# Altium project PCB_PROJECT1.PRJPCB
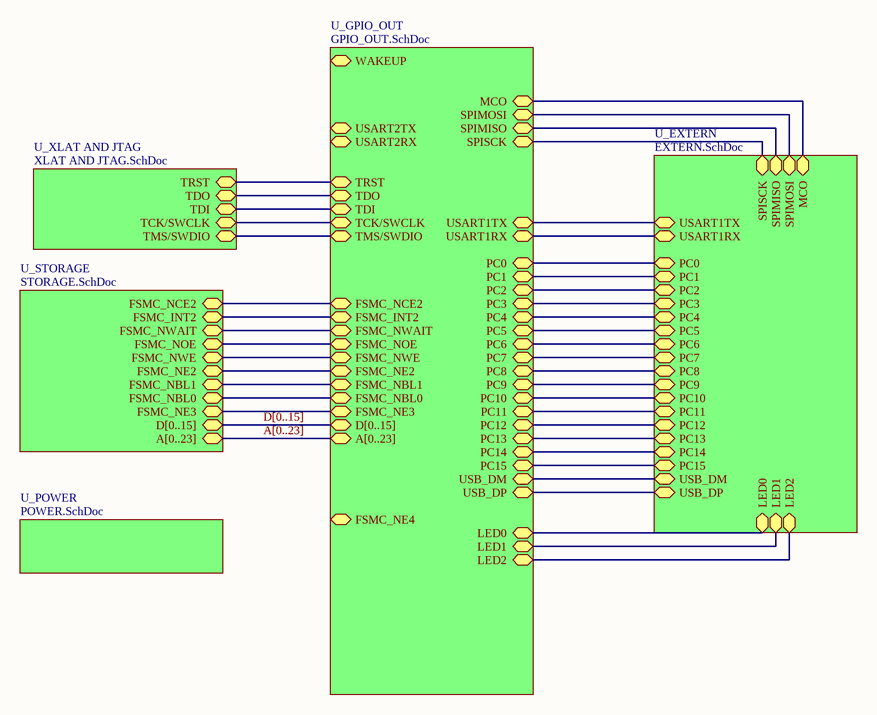
[diagram p0: main.SchDoc]
5 sheets, 53 parts. Net scope: global (net labels, ports and power ports of the same name join across sheets).
Board files: PCB3.PcbDoc, trd5.PcbDoc, PCB2CPY.PcbDoc, PCB2.PcbDoc
Sheets:
  main.SchDoc
    U_GPIO_OUT = GPIO_OUT.SchDoc
    U_XLAT AND JTAG = XLAT AND JTAG.SchDoc
    U_EXTERN = EXTERN.SchDoc
    U_POWER = POWER.SchDoc

## Sheet main.SchDoc
size A4; PageSetup: Record=PageOptions|CenterHorizontal=True|CenterVertical=True|PrintScale=1.00|XCorrection=1.00|YCorrection=1.00|PrintKind=2|BorderSize=5000000|LeftOffset=0|BottomOffset=0|Orientation=2|PaperLength=1000|PaperWidth=1000|Scale=100|PaperSource=7|PrintQuality=-4|MediaType=1|DitherType=10|PaperKind=A4|PrintScaleMode=1

### Sub-sheets
U_EXTERN = EXTERN.SchDoc: USB_DM (bidir), USB_DP (bidir), LED0 (bidir), LED1 (bidir), LED2 (bidir), USART1TX (bidir), USART1RX (bidir), PC0 (bidir), PC1 (bidir), PC2 (bidir), PC3 (bidir), PC4 (bidir), PC5 (bidir), PC6 (bidir), PC7 (bidir), PC8 (bidir), PC9 (bidir), PC10 (bidir), PC11 (bidir), PC12 (bidir), PC13 (bidir), PC14 (bidir), PC15 (bidir), SPISCK (bidir), SPIMISO (bidir), SPIMOSI (bidir), MCO (bidir)
U_GPIO_OUT = GPIO_OUT.SchDoc: WAKEUP (bidir), USART2TX (bidir), USART2RX (bidir), SPISCK (bidir), SPIMISO (bidir), SPIMOSI (bidir), MCO (bidir), USART1TX (bidir), USART1RX (bidir), TMS/SWDIO (bidir), TCK/SWCLK (bidir), TDI (bidir), TDO (bidir), TRST (bidir), A[0..23] (bidir), D[0..15] (bidir), USB_DM (bidir), USB_DP (bidir), FSMC_NE4 (bidir), FSMC_NE3 (bidir), FSMC_NE2 (bidir), FSMC_INT2 (bidir), FSMC_NBL1 (bidir), FSMC_NBL0 (bidir), FSMC_NCE2 (bidir), FSMC_NWAIT (bidir), FSMC_NWE (bidir), FSMC_NOE (bidir), LED0 (bidir), LED1 (bidir), LED2 (bidir), PC0 (bidir), PC1 (bidir), PC2 (bidir), PC3 (bidir), PC4 (bidir), PC5 (bidir), PC6 (bidir), PC7 (bidir), PC8 (bidir), PC9 (bidir), PC10 (bidir), PC11 (bidir), PC12 (bidir), PC13 (bidir), PC14 (bidir), PC15 (bidir)
U_POWER = POWER.SchDoc: no entries
U_STORAGE = STORAGE.SchDoc (file not in this document): A[0..23] (bidir), D[0..15] (bidir), FSMC_NE3 (bidir), FSMC_NBL0 (bidir), FSMC_NBL1 (bidir), FSMC_NE2 (bidir), FSMC_NWE (bidir), FSMC_NOE (bidir), FSMC_NWAIT (bidir), FSMC_INT2 (bidir), FSMC_NCE2 (bidir)
U_XLAT AND JTAG = XLAT AND JTAG.SchDoc: TMS/SWDIO (bidir), TCK/SWCLK (bidir), TDI (bidir), TDO (bidir), TRST (bidir)

### Nets
(unnamed): sheet U_GPIO_OUT/SPISCK, sheet U_EXTERN/SPISCK
(unnamed): sheet U_GPIO_OUT/SPIMISO, sheet U_EXTERN/SPIMISO
(unnamed): sheet U_GPIO_OUT/SPIMOSI, sheet U_EXTERN/SPIMOSI
(unnamed): sheet U_GPIO_OUT/MCO, sheet U_EXTERN/MCO
(unnamed): sheet U_GPIO_OUT/USART1TX, sheet U_EXTERN/USART1TX
(unnamed): sheet U_GPIO_OUT/USART1RX, sheet U_EXTERN/USART1RX
(unnamed): sheet U_GPIO_OUT/TMS/SWDIO, sheet U_XLAT AND JTAG/TMS/SWDIO
(unnamed): sheet U_GPIO_OUT/TCK/SWCLK, sheet U_XLAT AND JTAG/TCK/SWCLK
(unnamed): sheet U_GPIO_OUT/TDI, sheet U_XLAT AND JTAG/TDI
(unnamed): sheet U_GPIO_OUT/TDO, sheet U_XLAT AND JTAG/TDO
(unnamed): sheet U_GPIO_OUT/TRST, sheet U_XLAT AND JTAG/TRST
(unnamed): sheet U_GPIO_OUT/USB_DM, sheet U_EXTERN/USB_DM
(unnamed): sheet U_GPIO_OUT/USB_DP, sheet U_EXTERN/USB_DP
(unnamed): sheet U_GPIO_OUT/FSMC_NE3, sheet U_STORAGE/FSMC_NE3
(unnamed): sheet U_GPIO_OUT/FSMC_NE2, sheet U_STORAGE/FSMC_NE2
(unnamed): sheet U_GPIO_OUT/FSMC_INT2, sheet U_STORAGE/FSMC_INT2
(unnamed): sheet U_GPIO_OUT/FSMC_NBL1, sheet U_STORAGE/FSMC_NBL1
(unnamed): sheet U_GPIO_OUT/FSMC_NBL0, sheet U_STORAGE/FSMC_NBL0
(unnamed): sheet U_GPIO_OUT/FSMC_NCE2, sheet U_STORAGE/FSMC_NCE2
(unnamed): sheet U_GPIO_OUT/FSMC_NWAIT, sheet U_STORAGE/FSMC_NWAIT
(unnamed): sheet U_GPIO_OUT/FSMC_NWE, sheet U_STORAGE/FSMC_NWE
(unnamed): sheet U_GPIO_OUT/FSMC_NOE, sheet U_STORAGE/FSMC_NOE
(unnamed): sheet U_GPIO_OUT/LED0, sheet U_EXTERN/LED0
(unnamed): sheet U_GPIO_OUT/LED1, sheet U_EXTERN/LED1
(unnamed): sheet U_GPIO_OUT/LED2, sheet U_EXTERN/LED2
(unnamed): sheet U_GPIO_OUT/PC0, sheet U_EXTERN/PC0
(unnamed): sheet U_GPIO_OUT/PC1, sheet U_EXTERN/PC1
(unnamed): sheet U_GPIO_OUT/PC2, sheet U_EXTERN/PC2
(unnamed): sheet U_GPIO_OUT/PC3, sheet U_EXTERN/PC3
(unnamed): sheet U_GPIO_OUT/PC4, sheet U_EXTERN/PC4
(unnamed): sheet U_GPIO_OUT/PC5, sheet U_EXTERN/PC5
(unnamed): sheet U_GPIO_OUT/PC6, sheet U_EXTERN/PC6
(unnamed): sheet U_GPIO_OUT/PC7, sheet U_EXTERN/PC7
(unnamed): sheet U_GPIO_OUT/PC8, sheet U_EXTERN/PC8
(unnamed): sheet U_GPIO_OUT/PC9, sheet U_EXTERN/PC9
(unnamed): sheet U_GPIO_OUT/PC10, sheet U_EXTERN/PC10
(unnamed): sheet U_GPIO_OUT/PC11, sheet U_EXTERN/PC11
(unnamed): sheet U_GPIO_OUT/PC12, sheet U_EXTERN/PC12
(unnamed): sheet U_GPIO_OUT/PC13, sheet U_EXTERN/PC13
(unnamed): sheet U_GPIO_OUT/PC14, sheet U_EXTERN/PC14
(unnamed): sheet U_GPIO_OUT/PC15, sheet U_EXTERN/PC15

### Buses and harness runs
bus A[0..23] = sheet U_GPIO_OUT/A[0..23] = sheet U_STORAGE/A[0..23]
bus D[0..15] = sheet U_GPIO_OUT/D[0..15] = sheet U_STORAGE/D[0..15]

## Sheet GPIO_OUT.SchDoc
size B
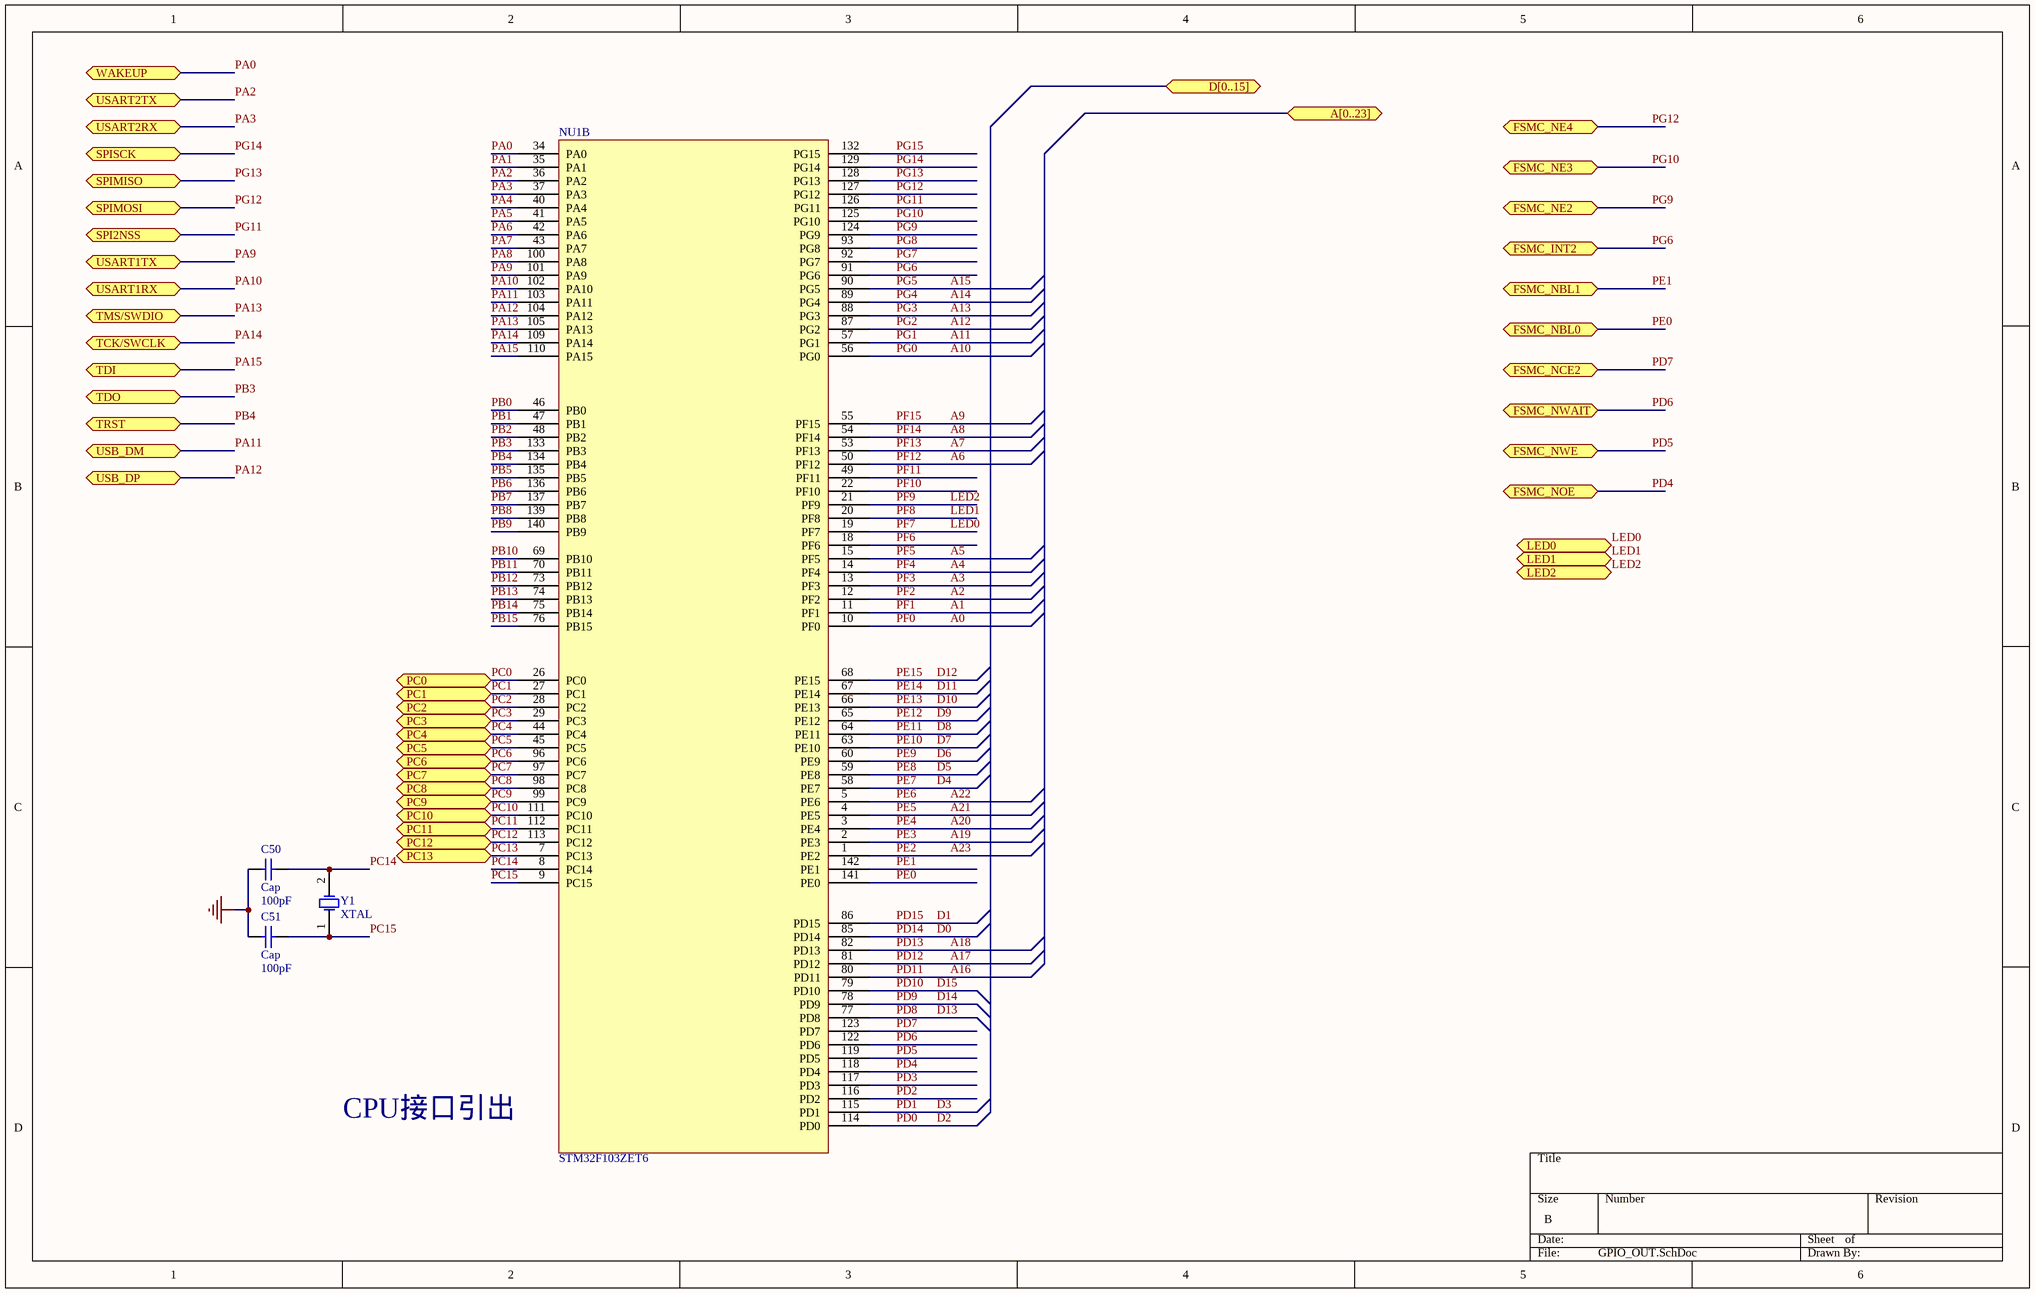
[diagram p1: GPIO_OUT.SchDoc]

### Parts
C50  Cap  value 100pF  [0805]
C51  Cap  value 100pF  [0805]
NU1  STM32F103ZET6  (part B of 3)
Y1  XTAL  [XTAL-1]

### Ports
A[0..23] (bidir), D[0..15] (bidir), FSMC_INT2 (bidir), FSMC_NBL0 (bidir), FSMC_NBL1 (bidir), FSMC_NCE2 (bidir), FSMC_NE2 (bidir), FSMC_NE3 (bidir), FSMC_NE4 (bidir), FSMC_NOE (bidir), FSMC_NWAIT (bidir), FSMC_NWE (bidir), LED0 (bidir), LED1 (bidir), LED2 (bidir), PC0 (bidir), PC1 (bidir), PC2 (bidir), PC3 (bidir), PC4 (bidir), PC5 (bidir), PC6 (bidir), PC7 (bidir), PC8 (bidir), PC9 (bidir), PC10 (bidir), PC11 (bidir), PC12 (bidir), PC13 (bidir), SPI2NSS (bidir), SPIMISO (bidir), SPIMOSI (bidir), SPISCK (bidir), TCK/SWCLK (bidir), TDI (bidir), TDO (bidir), TMS/SWDIO (bidir), TRST (bidir), USART1RX (bidir), USART1TX (bidir), USART2RX (bidir), USART2TX (bidir), USB_DM (bidir), USB_DP (bidir), WAKEUP (bidir)

### Nets
GND: C50.1 C51.1
A0: NU1.10(PF0)  [also labelled PF0]
A1: NU1.11(PF1)  [also labelled PF1]
A2: NU1.12(PF2)  [also labelled PF2]
A3: NU1.13(PF3)  [also labelled PF3]
A4: NU1.14(PF4)  [also labelled PF4]
A5: NU1.15(PF5)  [also labelled PF5]
A6: NU1.50(PF12)  [also labelled PF12]
A7: NU1.53(PF13)  [also labelled PF13]
A8: NU1.54(PF14)  [also labelled PF14]
A9: NU1.55(PF15)  [also labelled PF15]
A10: NU1.56(PG0)  [also labelled PG0]
A11: NU1.57(PG1)  [also labelled PG1]
A12: NU1.87(PG2)  [also labelled PG2]
A13: NU1.88(PG3)  [also labelled PG3]
A14: NU1.89(PG4)  [also labelled PG4]
A15: NU1.90(PG5)  [also labelled PG5]
A16: NU1.80(PD11)  [also labelled PD11]
A17: NU1.81(PD12)  [also labelled PD12]
A18: NU1.82(PD13)  [also labelled PD13]
A19: NU1.2(PE3)  [also labelled PE3]
A20: NU1.3(PE4)  [also labelled PE4]
A21: NU1.4(PE5)  [also labelled PE5]
A22: NU1.5(PE6)  [also labelled PE6]
A23: NU1.1(PE2)  [also labelled PE2]
D0: NU1.85(PD14)  [also labelled PD14]
D1: NU1.86(PD15)  [also labelled PD15]
D2: NU1.114(PD0)  [also labelled PD0]
D3: NU1.115(PD1)  [also labelled PD1]
D4: NU1.58(PE7)  [also labelled PE7]
D5: NU1.59(PE8)  [also labelled PE8]
D6: NU1.60(PE9)  [also labelled PE9]
D7: NU1.63(PE10)  [also labelled PE10]
D8: NU1.64(PE11)  [also labelled PE11]
D9: NU1.65(PE12)  [also labelled PE12]
D10: NU1.66(PE13)  [also labelled PE13]
D11: NU1.67(PE14)  [also labelled PE14]
D12: NU1.68(PE15)  [also labelled PE15]
D13: NU1.77(PD8)  [also labelled PD8]
D14: NU1.78(PD9)  [also labelled PD9]
D15: NU1.79(PD10)  [also labelled PD10]
LED0: NU1.19(PF7) ; port LED0  [also labelled PF7]
LED1: NU1.20(PF8) ; port LED1  [also labelled PF8]
LED2: NU1.21(PF9) ; port LED2  [also labelled PF9]
PA0: NU1.34(PA0) ; port WAKEUP
PA1: NU1.35(PA1)
PA2: NU1.36(PA2) ; port USART2TX
PA3: NU1.37(PA3) ; port USART2RX
PA4: NU1.40(PA4)
PA5: NU1.41(PA5)
PA6: NU1.42(PA6)
PA7: NU1.43(PA7)
PA8: NU1.100(PA8)
PA9: NU1.101(PA9) ; port USART1TX
PA10: NU1.102(PA10) ; port USART1RX
PA11: NU1.103(PA11) ; port USB_DM
PA12: NU1.104(PA12) ; port USB_DP
PA13: NU1.105(PA13) ; port TMS/SWDIO
PA14: NU1.109(PA14) ; port TCK/SWCLK
PA15: NU1.110(PA15) ; port TDI
PB0: NU1.46(PB0)
PB1: NU1.47(PB1)
PB2: NU1.48(PB2)
PB3: NU1.133(PB3) ; port TDO
PB4: NU1.134(PB4) ; port TRST
PB5: NU1.135(PB5)
PB6: NU1.136(PB6)
PB7: NU1.137(PB7)
PB8: NU1.139(PB8)
PB9: NU1.140(PB9)
PB10: NU1.69(PB10)
PB11: NU1.70(PB11)
PB12: NU1.73(PB12)
PB13: NU1.74(PB13)
PB14: NU1.75(PB14)
PB15: NU1.76(PB15)
PC0: NU1.26(PC0) ; port PC0
PC1: NU1.27(PC1) ; port PC1
PC2: NU1.28(PC2) ; port PC2
PC3: NU1.29(PC3) ; port PC3
PC4: NU1.44(PC4) ; port PC4
PC5: NU1.45(PC5) ; port PC5
PC6: NU1.96(PC6) ; port PC6
PC7: NU1.97(PC7) ; port PC7
PC8: NU1.98(PC8) ; port PC8
PC9: NU1.99(PC9) ; port PC9
PC10: NU1.111(PC10) ; port PC10
PC11: NU1.112(PC11) ; port PC11
PC12: NU1.113(PC12) ; port PC12
PC13: NU1.7(PC13) ; port PC13
PC14: C50.2 NU1.8(PC14) Y1.2(OSC2)
PC15: C51.2 NU1.9(PC15) Y1.1(OSC1)
PD2: NU1.116(PD2)
PD3: NU1.117(PD3)
PD4: NU1.118(PD4) ; port FSMC_NOE
PD5: NU1.119(PD5) ; port FSMC_NWE
PD6: NU1.122(PD6) ; port FSMC_NWAIT
PD7: NU1.123(PD7) ; port FSMC_NCE2
PE0: NU1.141(PE0) ; port FSMC_NBL0
PE1: NU1.142(PE1) ; port FSMC_NBL1
PF6: NU1.18(PF6)
PF10: NU1.22(PF10)
PF11: NU1.49(PF11)
PG6: NU1.91(PG6) ; port FSMC_INT2
PG7: NU1.92(PG7)
PG8: NU1.93(PG8)
PG9: NU1.124(PG9) ; port FSMC_NE2
PG10: NU1.125(PG10) ; port FSMC_NE3
PG11: NU1.126(PG11) ; port SPI2NSS
PG12: NU1.127(PG12) ; port SPIMOSI, port FSMC_NE4
PG13: NU1.128(PG13) ; port SPIMISO
PG14: NU1.129(PG14) ; port SPISCK
PG15: NU1.132(PG15)

### Notes on the sheet
- CPU接口引出

### Library data of the parts
C50 C51 = Cap: Capacitor; Published: 8-Jun-2000; LatestRevisionDate: 17-Jul-2002; LatestRevisionNote: Re-released for DXP Platform.; PackageReference: RAD-0.3; Publisher: Altium Limited
Y1 = XTAL: Crystal Oscillator; Published: 8-Jun-2000; LatestRevisionDate: 17-Jul-2002; LatestRevisionNote: Re-released for DXP Platform.; PackageReference: R38; Publisher: Altium Limited

## Sheet XLAT AND JTAG.SchDoc
size A4
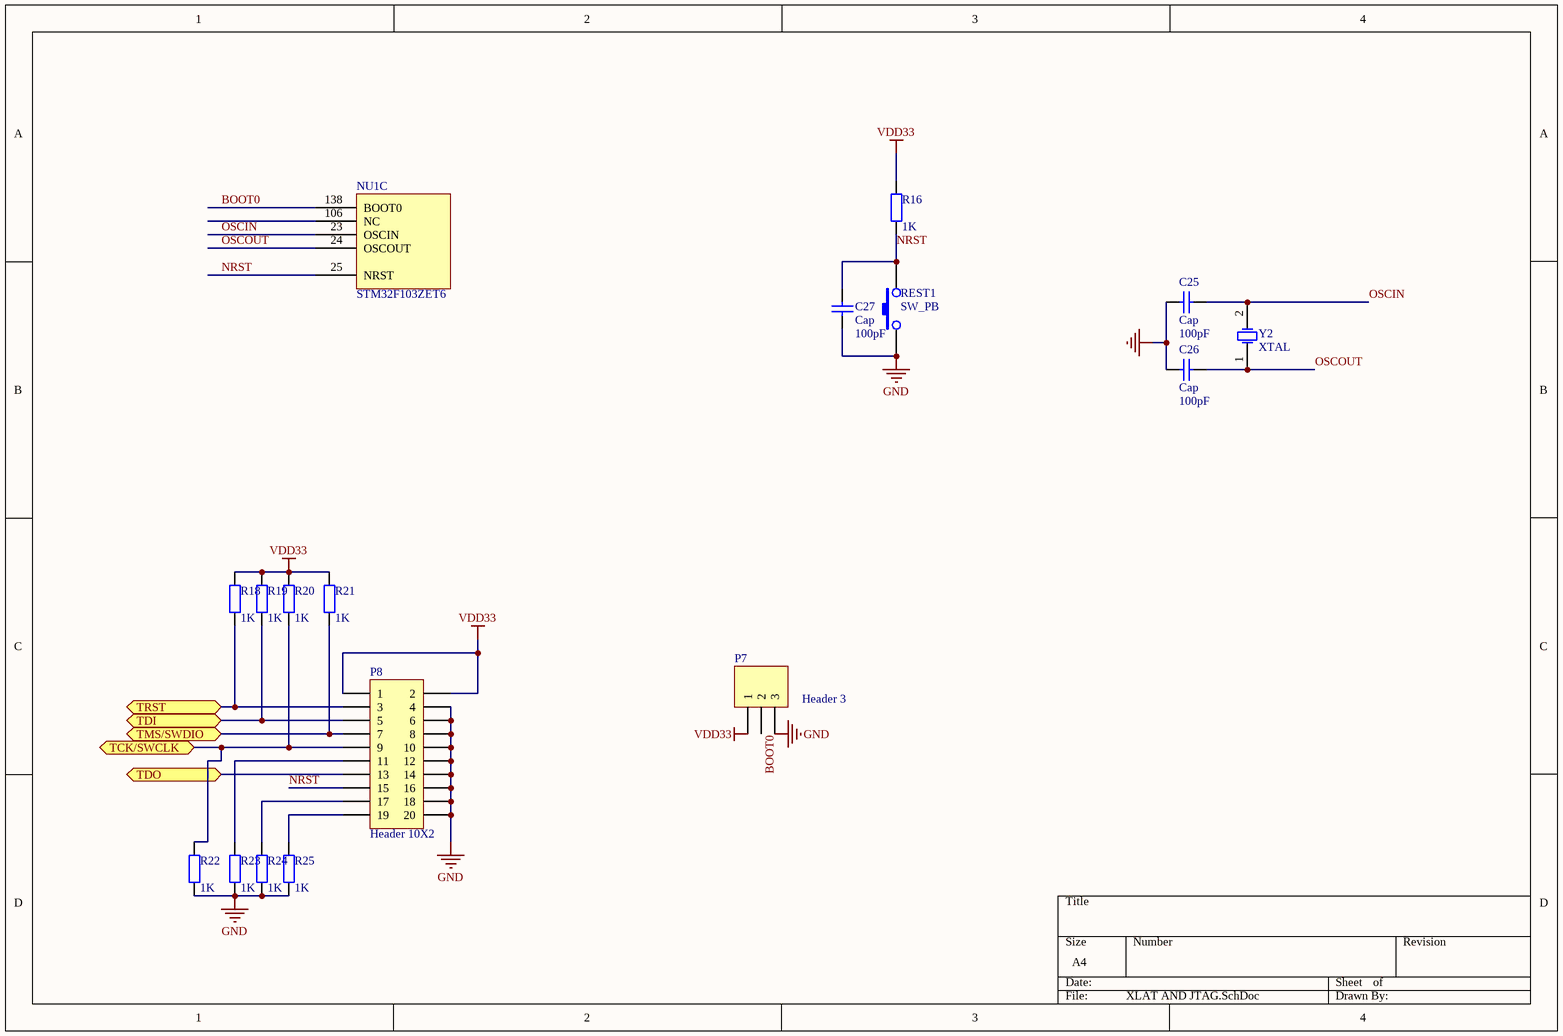
[diagram p2: XLAT AND JTAG.SchDoc]

### Parts
C25  Cap  value 100pF  [0805]
C26  Cap  value 100pF  [0805]
C27  Cap  value 100pF  [0805]
NU1  STM32F103ZET6  [LQFN144]  (part C of 3)
P7  Header 3  [HDR1X3]
P8  Header 10X2  [HDR2X10]
R16  value 1K  [0805]  (hidden comment: Res2)
R18  value 1K  [0805]  (hidden comment: Res2)
R19  value 1K  [0805]  (hidden comment: Res2)
R20  value 1K  [0805]  (hidden comment: Res2)
R21  value 1K  [0805]  (hidden comment: Res2)
R22  value 1K  [0805]  (hidden comment: Res2)
R23  value 1K  [0805]  (hidden comment: Res2)
R24  value 1K  [0805]  (hidden comment: Res2)
R25  value 1K  [0805]  (hidden comment: Res2)
REST1  SW_PB  [SWPB]
Y2  XTAL  [XTAL-1]

### Ports
TCK/SWCLK (bidir), TDI (bidir), TDO (bidir), TMS/SWDIO (bidir), TRST (bidir)

### Nets
GND: C25.1 C26.1 C27.1 P7.3 P8.4 P8.6 P8.8 P8.10 P8.12 P8.14 P8.16 P8.18 P8.20 R22.2 R23.2 R24.2 R25.2 REST1.1
VDD33: P7.1 P8.1 P8.2 R16.2 R18.2 R19.2 R20.2 R21.2
BOOT0: NU1.138(BOOT0) P7.2
NRST: C27.2 NU1.25(NRST) P8.15 R16.1 REST1.2
OSCIN: C25.2 NU1.23(OSCIN) Y2.2(OSC2)
OSCOUT: C26.2 NU1.24(OSCOUT) Y2.1(OSC1)
PA13: P8.7 R21.1 ; port TMS/SWDIO
PA14: P8.9 R20.1 R22.1 ; port TCK/SWCLK
PA15: P8.5 R19.1 ; port TDI
PB3: P8.13 ; port TDO
PB4: P8.3 R18.1 ; port TRST
NetP8_11: P8.11 R23.1
NetP8_17: P8.17 R24.1
NetP8_19: P8.19 R25.1

Not connected (* = marked no-connect by the designer): NU1 106(NC)

### Library data of the parts
C25-C27 = Cap: Capacitor; Published: 8-Jun-2000; LatestRevisionDate: 17-Jul-2002; LatestRevisionNote: Re-released for DXP Platform.; PackageReference: RAD-0.3; Publisher: Altium Limited
P7 = Header 3: Header, 3-Pin; LatestRevisionDate: 17-Jul-2002; LatestRevisionNote: Re-released for DXP Platform.; Publisher: Altium Limited
P8 = Header 10X2: Header, 10-Pin, Dual row; LatestRevisionDate: 17-Jul-2002; LatestRevisionNote: Re-released for DXP Platform.; Publisher: Altium Limited
R16 R18-R25 = Res2: Resistor; Published: 8-Jun-2000; LatestRevisionDate: 17-Jul-2002; LatestRevisionNote: Re-released for DXP Platform.; PackageReference: AXIAL-0.4; Publisher: Altium Limited
Y2 = XTAL: Crystal Oscillator; Published: 8-Jun-2000; LatestRevisionDate: 17-Jul-2002; LatestRevisionNote: Re-released for DXP Platform.; PackageReference: R38; Publisher: Altium Limited

## Sheet EXTERN.SchDoc
size A4
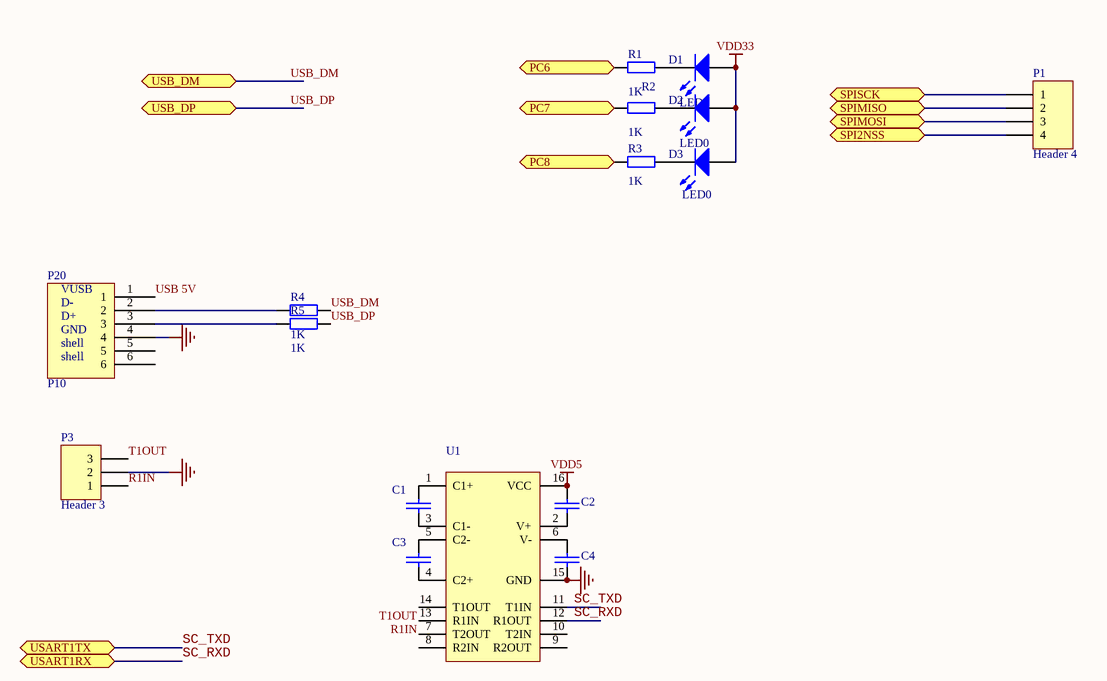
[diagram p3: EXTERN.SchDoc]

### Parts
C1  0.1uF  [0805]  (value not drawn)
C2  0.1uF  [0805]  (value not drawn)
C3  0.1uF  [0805]  (value not drawn)
C4  0.1uF  [0805]  (value not drawn)
D1  LED0  [0805]
D2  LED0  [0805]
D3  LED0  [0805]
P1  Header 4  [HDR1X4]
P3  Header 3  [HDR1X3]
P20  P10  [787616]
R1  value 1K  [0805]  (hidden comment: Res2)
R2  value 1K  [0805]  (hidden comment: Res2)
R3  value 1K  [0805]  (hidden comment: Res2)
R4  value 1K  [0805]  (hidden comment: Res2)
R5  value 1K  [0805]  (hidden comment: Res2)
U1  MAX232-2  [SOIC16]  (value not drawn)

### Ports
PC6 (bidir), PC7 (bidir), PC8 (bidir), SPI2NSS (bidir), SPIMISO (bidir), SPIMOSI (bidir), SPISCK (bidir), USART1RX (bidir), USART1TX (bidir), USB_DM (bidir), USB_DP (bidir)

### Nets
GND: C4.2 P3.2 P20.4 U1.15(GND)
VDD5: C2.1 U1.16(VCC)
VDD33: D1.1(A) D2.1(A) D3.1(A)
PC6: R1.1 ; port PC6
PC7: R2.1 ; port PC7
PC8: R3.1 ; port PC8
PG11: P1.4 ; port SPI2NSS
PG12: P1.3 ; port SPIMOSI
PG13: P1.2 ; port SPIMISO
PG14: P1.1 ; port SPISCK
R1IN: P3.1 U1.13(R1IN)
SC_RXD: U1.12(R1OUT) ; port USART1RX  [project net PA10]
SC_TXD: U1.11(T1IN) ; port USART1TX  [project net PA9]
T1OUT: P3.3 U1.14(T1OUT)
USB 5V: P20.1
USB_DM: R4.2 ; port USB_DM  [project net PA11]
USB_DP: R5.2 ; port USB_DP  [project net PA12]
NetC1_1: C1.1 U1.1(C1+)
NetC1_2: C1.2 U1.3(C1-)
NetC2_2: C2.2 U1.2(V+)
NetC3_1: C3.1 U1.5(C2-)
NetC3_2: C3.2 U1.4(C2+)
NetC4_1: C4.1 U1.6(V-)
NetD1_2: D1.2(K) R1.2
NetD2_2: D2.2(K) R2.2
NetD3_2: D3.2(K) R3.2
NetP20_2: P20.2 R4.1
NetP20_3: P20.3 R5.1

Not connected (* = marked no-connect by the designer): P20 5 6; U1 7(T2OUT) 8(R2IN) 9(R2OUT) 10(T2IN)

### Notes on the sheet
- (in symbol COMPONENT_1) VUSB; D-; D+; GND; shell

### Library data of the parts
C1-C4 = CAP: Capacitor
D1-D3 = LED0: Typical INFRARED GaAs LED; Published: 8-Jun-2000; LatestRevisionDate: 08-Jul-2005; LatestRevisionNote: Mech Layer 1 removed.; PackageReference: LED-0; Publisher: Altium Limited
P1 = Header 4: Header, 4-Pin; LatestRevisionDate: 17-Jul-2002; LatestRevisionNote: Re-released for DXP Platform.; Publisher: Altium Limited
P3 = Header 3: Header, 3-Pin; LatestRevisionDate: 17-Jul-2002; LatestRevisionNote: Re-released for DXP Platform.; Publisher: Altium Limited
P20 = COMPONENT_1
R1-R5 = Res2: Resistor; Published: 8-Jun-2000; LatestRevisionDate: 17-Jul-2002; LatestRevisionNote: Re-released for DXP Platform.; PackageReference: AXIAL-0.4; Publisher: Altium Limited
U1 = MAX3232-2

## Sheet POWER.SchDoc
size A
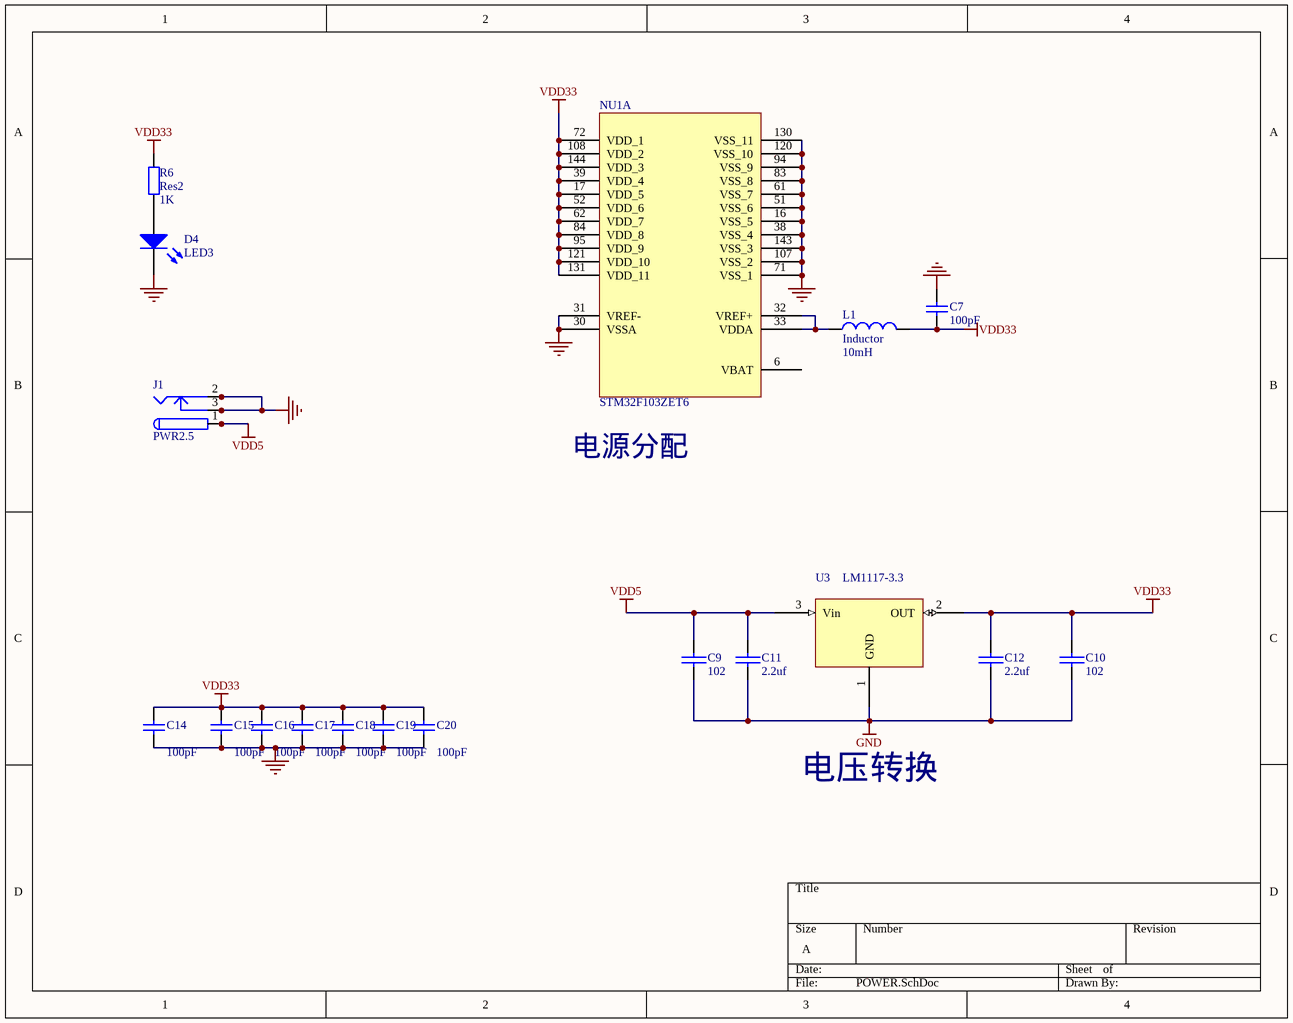
[diagram p4: POWER.SchDoc]

### Parts
C7  value 100pF  [6-0805]  (hidden comment: Cap)
C9  102  [0805]
C10  102  [0805]
C11  2.2uf  [1210]
C12  2.2uf  [1210]
C14  value 100pF  [6-0805]  (hidden comment: Cap)
C15  value 100pF  [6-0805]  (hidden comment: Cap)
C16  value 100pF  [6-0805]  (hidden comment: Cap)
C17  value 100pF  [6-0805]  (hidden comment: Cap)
C18  value 100pF  [6-0805]  (hidden comment: Cap)
C19  value 100pF  [6-0805]  (hidden comment: Cap)
C20  value 100pF  [6-0805]  (hidden comment: Cap)
D4  LED3  [0805]
J1  PWR2.5  [Power_In]
L1  Inductor  value 10mH  [6-0805]
NU1  STM32F103ZET6  [LQFN144]  (part A of 3)
R6  Res2  value 1K  [0805]
U3  LM1117-3.3  [SOT-223]

### Nets
GND: C7.1 C9.2 C10.2 C11.2 C12.2 C14.1 C15.1 C16.1 C17.1 C18.1 C19.1 C20.1 D4.2(K) J1.2 J1.2B J1.3 J1.3B NU1.16(VSS_5) NU1.30(VSSA) NU1.31(VREF-) NU1.38(VSS_4) NU1.51(VSS_6) NU1.61(VSS_7) NU1.71(VSS_1) NU1.83(VSS_8) NU1.94(VSS_9) NU1.107(VSS_2) NU1.120(VSS_10) NU1.130(VSS_11) NU1.143(VSS_3) U3.1(GND)
VDD5: C9.1 C11.1 J1.1 J1.1B U3.3(Vin)
VDD33: C7.2 C10.1 C12.1 C14.2 C15.2 C16.2 C17.2 C18.2 C19.2 C20.2 L1.2 NU1.17(VDD_5) NU1.39(VDD_4) NU1.52(VDD_6) NU1.62(VDD_7) NU1.72(VDD_1) NU1.84(VDD_8) NU1.95(VDD_9) NU1.108(VDD_2) NU1.121(VDD_10) NU1.131(VDD_11) NU1.144(VDD_3) R6.2 U3.2(OUT)
NetD4_1: D4.1(A) R6.1
NetL1_1: L1.1 NU1.32(VREF+) NU1.33(VDDA)

Not connected (* = marked no-connect by the designer): NU1 6(VBAT)

### Notes on the sheet
- 电源分配
- 电压转换

### Library data of the parts
C7 C14-C20 = Cap: Capacitor; Published: 8-Jun-2000; LatestRevisionDate: 17-Jul-2002; LatestRevisionNote: Re-released for DXP Platform.; PackageReference: RAD-0.3; Publisher: Altium Limited
C9-C12 = CAP: Capacitor
D4 = LED3: Typical BLUE SiC LED; Published: 8-Jun-2000; LatestRevisionDate: 17-Dec-2003; LatestRevisionNote: PCB Footprint replaced.; DatasheetDocument: 16-Apr-2002; PackageDocument: 16-Apr-2002; PackageReference: 3.5X2.8X1.9; Publisher: Altium Limited
J1 = PWR2.5: Low Voltage Power Supply Connector; Published: 17-Dec-2003; DatasheetDocument: 09-May-2002; Publisher: Altium Limited; ComponentLink1Description: Manufacturer Link; ComponentLink1URL: http://domino.kycon.com/internet/Products.html
L1 = Inductor: Code_IEC: 1005; Published: 8-Jun-2000; LatestRevisionDate: 17-Jul-2002; LatestRevisionNote: Re-released for DXP Platform.; PackageReference: 0402-A; Publisher: Altium Limited; Code_JEITA: 0402
R6 = Res2: Resistor; Published: 8-Jun-2000; LatestRevisionDate: 17-Jul-2002; LatestRevisionNote: Re-released for DXP Platform.; PackageReference: AXIAL-0.4; Publisher: Altium Limited

## Nets that join several sheets
GND: GPIO_OUT (C50.1 C51.1), XLAT AND JTAG (18 pins), EXTERN (C4.2 P3.2 P20.4 U1.15), POWER (31 pins)
VDD5: EXTERN (C2.1 U1.16), POWER (5 pins)
VDD33: XLAT AND JTAG (8 pins), EXTERN (D1.1 D2.1 D3.1), POWER (24 pins)
PA9: GPIO_OUT (NU1.101), EXTERN (U1.11)
PA10: GPIO_OUT (NU1.102), EXTERN (U1.12)
PA11: GPIO_OUT (NU1.103), EXTERN (R4.2)
PA12: GPIO_OUT (NU1.104), EXTERN (R5.2)
PA13: GPIO_OUT (NU1.105), XLAT AND JTAG (P8.7 R21.1)
PA14: GPIO_OUT (NU1.109), XLAT AND JTAG (P8.9 R20.1 R22.1)
PA15: GPIO_OUT (NU1.110), XLAT AND JTAG (P8.5 R19.1)
PB3: GPIO_OUT (NU1.133), XLAT AND JTAG (P8.13)
PB4: GPIO_OUT (NU1.134), XLAT AND JTAG (P8.3 R18.1)
PC6: GPIO_OUT (NU1.96), EXTERN (R1.1)
PC7: GPIO_OUT (NU1.97), EXTERN (R2.1)
PC8: GPIO_OUT (NU1.98), EXTERN (R3.1)
PG11: GPIO_OUT (NU1.126), EXTERN (P1.4)
PG12: GPIO_OUT (NU1.127), EXTERN (P1.3)
PG13: GPIO_OUT (NU1.128), EXTERN (P1.2)
PG14: GPIO_OUT (NU1.129), EXTERN (P1.1)